# Altium schematic sheet Sheet_1_2026-07-22.schdoc
size 44 x 48 mm
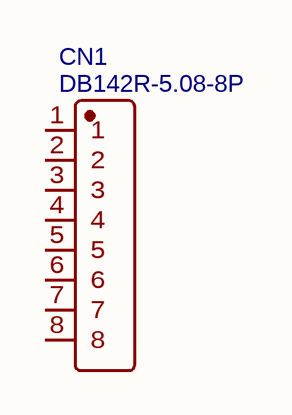
[diagram p0: Sheet_1_2026-07-22.schdoc]

## Parts
CN1  DB142R-5.08-8P  [CONN-TH_8P-P5.08_DIBO_DB142R-5.08-8P]

## Nets

Not connected (* = marked no-connect by the designer): CN1 1 2 3 4 5 6 7 8

## Library data of the parts
CN1 = DB142R-5.08-8P: Manufacturer: DORABO(地博电气); Manufacturer Part: DB142R-5.08-8P-GN; Contributor: LCSC; Supplier: LCSC; Supplier Part: C2898715; JLCPCB Part Class: Extended Part; spicePre: C; spiceSymbolName: DB142R-5.08-8P